# EasyEDA Pro project Hacker Card Schematic.epro

# Schematic Hacker card
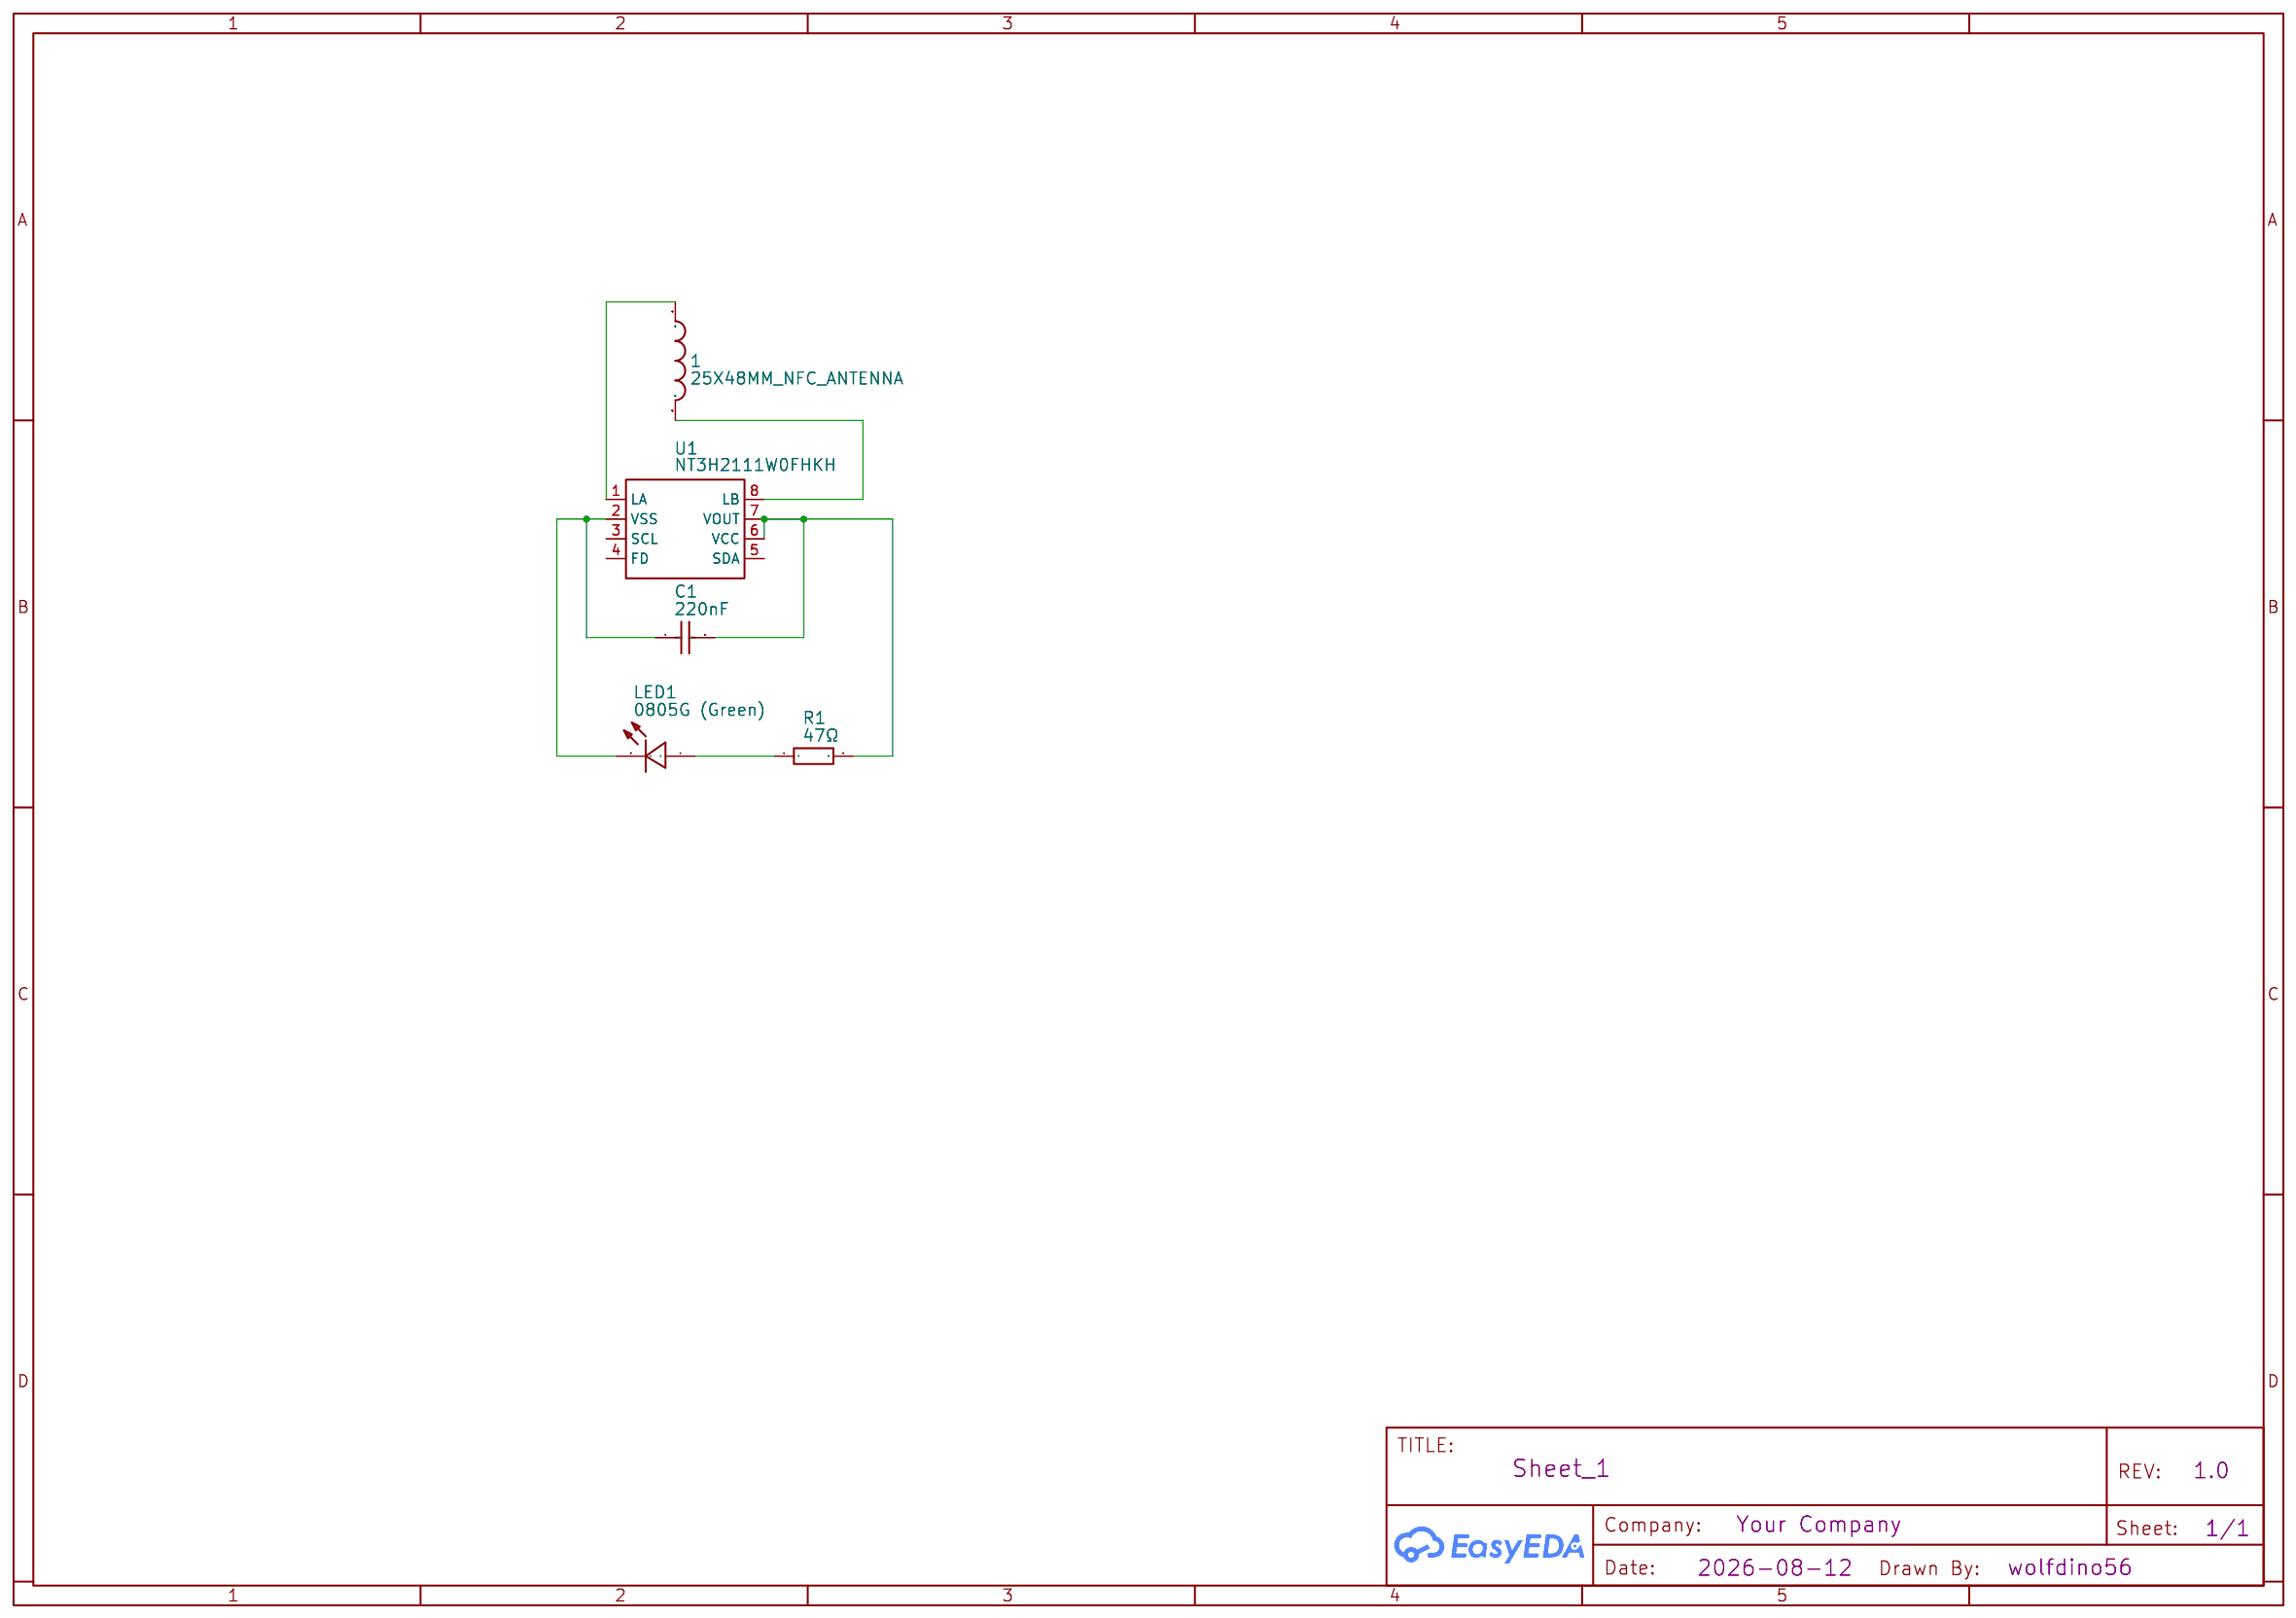
[diagram p0: schematic sheet]

## Parts
1  25X48MM_NFC_ANTENNA  [25X48MM_NFC_ANTENNA]
C1  220nF  [C0603]
LED1  0805G (Green)  [LED0805-R-RD]
R1  47Ω  [R0603]
U1  NT3H2111W0FHKH  [XQFN-8_L1.6-W1.6-P0.50-BL_NT3H2111W0FHKH]

## Library data of the parts
1 = 25X48MM_NFC_ANTENNA
C1 = 220nF: Supplier: LCSC; Manufacturer Part: CL10B224KA8NNNC; Manufacturer: SAMSUNG(三星); Supplier Part: C21120; JLCPCB Part Class: Basic Part; Origin 3D Model Title: C0603_L1.6-W0.8-H0.8
LED1 = 0805G (Green): Supplier: LCSC; Manufacturer: KENTO; Manufacturer Part: KT-0805G; Supplier Part: C2297; JLCPCB Part Class: Basic Part; Origin 3D Model Title: LED0805-RD
R1 = 47Ω: Supplier: LCSC; Manufacturer: UNI-ROYAL(厚声); Manufacturer Part: 0603WAF470JT5E; Supplier Part: C23182; JLCPCB Part Class: Basic Part
U1 = NT3H2111W0FHKH: Supplier: LCSC; Supplier Part: C710403; Manufacturer: NXP(恩智浦); JLCPCB Part Class: Extended Part

## Nets
Net-(1-P$1): 1.P$1 U1.1(LA)
Net-(1-P$2): 1.P$2 U1.8(LB)
Net-(C1-1): C1.1 LED1.2(K) U1.2(VSS)
Net-(C1-2): C1.2 R1.2 U1.6(VCC) U1.7(VOUT)
Net-(LED1-1): LED1.1(A) R1.1

Not connected (* = marked no-connect by the designer): U1 3(SCL) 4(FD) 5(SDA)
